# Altium schematic sheet Primavera.SchDoc
size A4
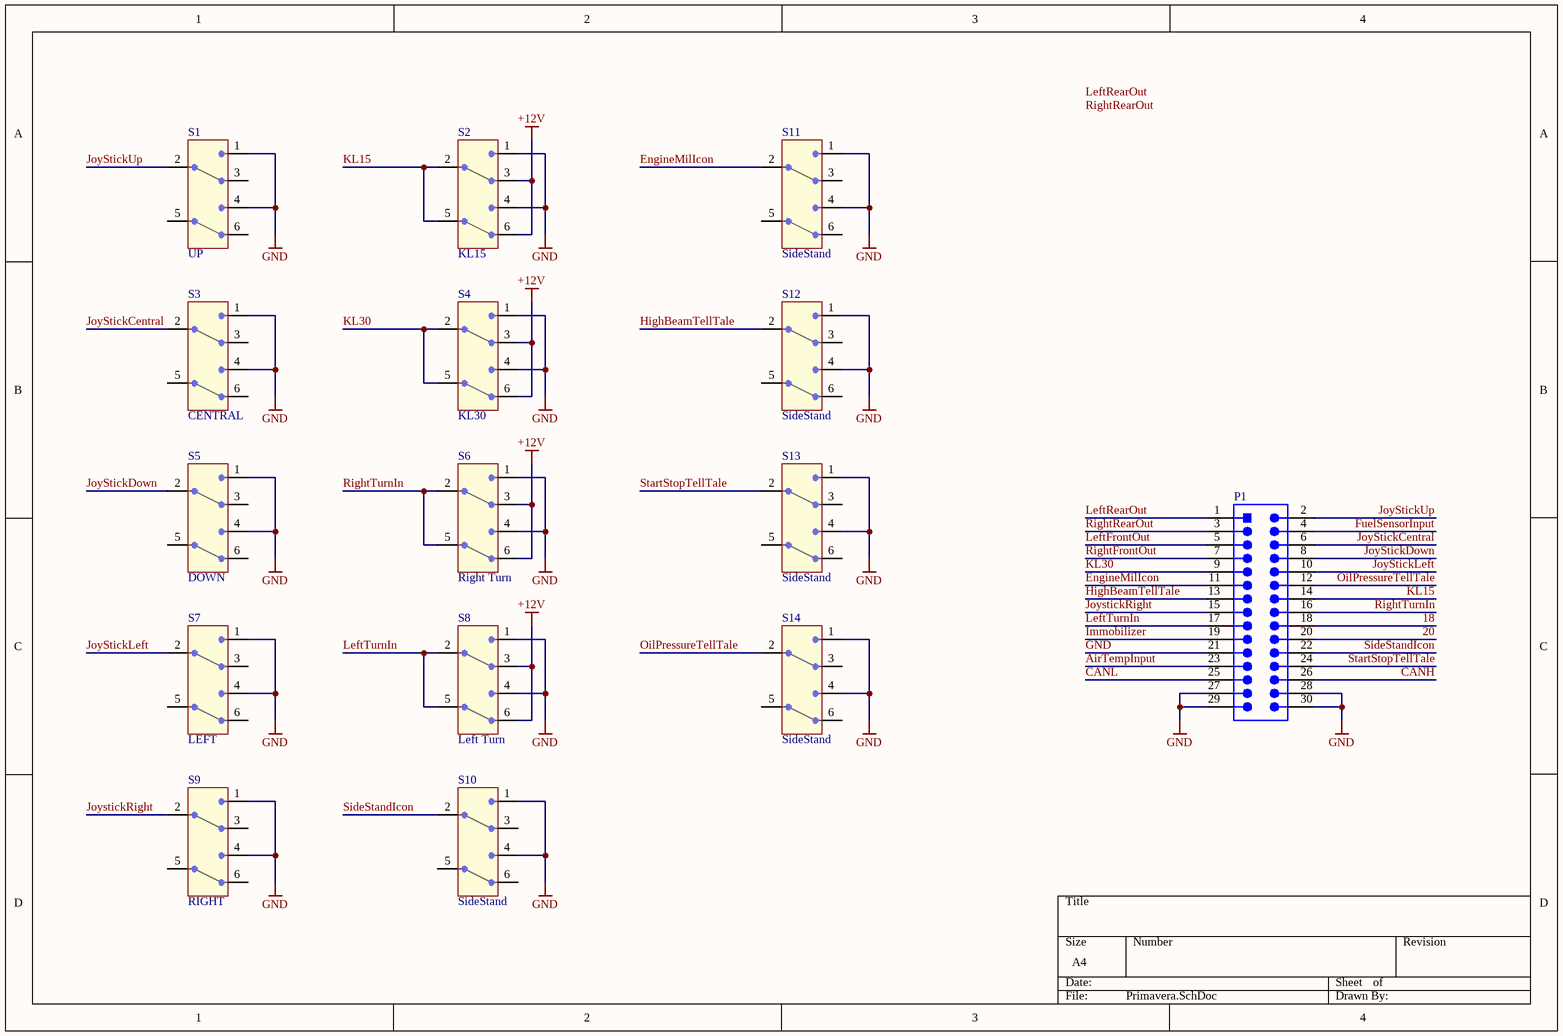
[diagram p0: Primavera.SchDoc]

## Parts
P1  _30  [61203421721 - 30pole]  (value not drawn)
S1  UP  [8.5x8.5_DPDT]
S2  KL15  [8.5x8.5_DPDT]
S3  CENTRAL  [8.5x8.5_DPDT]
S4  KL30  [8.5x8.5_DPDT]
S5  DOWN  [8.5x8.5_DPDT]
S6  Right Turn  [8.5x8.5_DPDT]
S7  LEFT  [8.5x8.5_DPDT]
S8  Left Turn  [8.5x8.5_DPDT]
S9  RIGHT  [8.5x8.5_DPDT]
S10  SideStand  [8.5x8.5_DPDT]
S11  SideStand  [8.5x8.5_DPDT]
S12  SideStand  [8.5x8.5_DPDT]
S13  SideStand  [8.5x8.5_DPDT]
S14  SideStand  [8.5x8.5_DPDT]

## Nets
+12V: S2.3 S2.6 S4.3 S4.6 S6.3 S6.6 S8.3 S8.6
GND: P1.21 P1.27 P1.28 P1.29 P1.30 S1.1 S1.4 S2.1 S2.4 S3.1 S3.4 S4.1 S4.4 S5.1 S5.4 S6.1 S6.4 S7.1 S7.4 S8.1 S8.4 S9.1 S9.4 S10.1 S10.4 S11.1 S11.4 S12.1 S12.4 S13.1 S13.4 S14.1 S14.4
18: P1.18
20: P1.20
AirTempInput: P1.23
CANH: P1.26
CANL: P1.25
EngineMilIcon: P1.11 S11.2
FuelSensorInput: P1.4
HighBeamTellTale: P1.13 S12.2
Immobilizer: P1.19
JoyStickCentral: P1.6 S3.2
JoyStickDown: P1.8 S5.2
JoyStickLeft: P1.10 S7.2
JoystickRight: P1.15 S9.2
JoyStickUp: P1.2 S1.2
KL15: P1.14 S2.2 S2.5
KL30: P1.9 S4.2 S4.5
LeftFrontOut: P1.5
LeftRearOut: P1.1
LeftTurnIn: P1.17 S8.2 S8.5
OilPressureTellTale: P1.12 S14.2
RightFrontOut: P1.7
RightRearOut: P1.3
RightTurnIn: P1.16 S6.2 S6.5
SideStandIcon: P1.22 S10.2
StartStopTellTale: P1.24 S13.2

Not connected (* = marked no-connect by the designer): S1 3 5 6; S3 3 5 6; S5 3 5 6; S7 3 5 6; S9 3 5 6; S10 3 5 6; S11 3 5 6; S12 3 5 6; S13 3 5 6; S14 3 5 6

## Notes on the sheet
- Labels drawn without touching a wire or pin: LeftRearOut, RightRearOut

## Library data of the parts
P1 = 61202622121_30: WR-BHD Box Header with short lever, Male, pitch 2.54mm, THT, Right Angle, 30p; Manufacturer: Wurth Elektronik; Contact Resistance: 20mOhm; Insulation Resistance: 1000MOhm; Number of Positions: 26; Rated Current: 3A; Withstanding Voltage: 500V; Working Voltage: 250V; ComponentLink1Description: Manufacturer Link; ComponentLink1URL: http://www.we-online.de; ComponentLink2Description: Datasheet; ComponentLink2URL: https://www.we-online.com/catalog/datasheet/61202622121.pdf; Gender: Male; Height: 8.3mm; Length: 52.32mm; Manufacturer Part Number: 61202622121; Mounting Technology: THT; Number of Rows: 2; Operating Temperature max.: 105C; Operating Temperature min.: -40C; Orientation: Right Angle; Packaging: Tray; Pitch: 2.54mm; Width: 24.5mm
S1-S14 = 8.5x8.5_DPDT